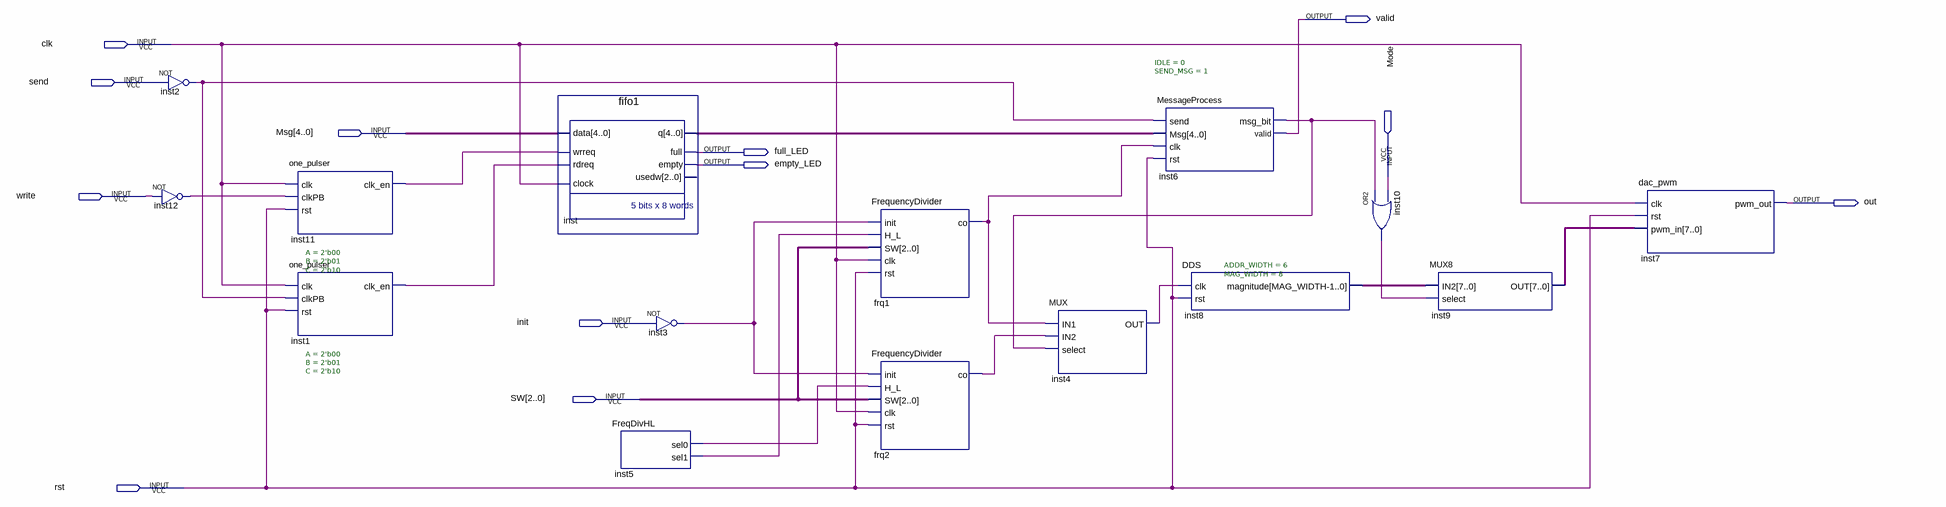
[diagram p0: schematic sheet]
// Quartus schematic DigitalModulation.bdf as structural Verilog: 15 symbols, 12 pins
module DigitalModulation (
  input  clk,
  input  send,
  input  [4:0] Msg,
  input  Mode,
  input  write,
  input  init,
  input  [2:0] SW,
  input  rst,
  output valid,
  output full_LED,
  output empty_LED,
  output out
);

  wire frq1_co, frq2_co, inst1_clk_en, inst2_out, inst3_out, inst4_out, inst5_sel0, inst5_sel1,
       inst6_msg_bit, inst10_out, inst11_clk_en, inst12_out;
  wire [4:0] inst_q;
  wire [7:0] inst8_magnitude, inst9_out;

  not inst2 (inst2_out, send);
  not inst12 (inst12_out, write);
  one_pulser #(.A(2'b00), .B(2'b01), .C(2'b10)) inst11 (
    .clk(clk), .clkPB(inst12_out), .rst(rst), .clk_en(inst11_clk_en));
  one_pulser #(.A(2'b00), .B(2'b01), .C(2'b10)) inst1 (.clk(clk), .clkPB(inst2_out), .rst(rst), .clk_en(inst1_clk_en));
  fifo1 inst (
    .data(Msg), .wrreq(inst11_clk_en), .rdreq(inst1_clk_en), .clock(clk), .q(inst_q), .full(full_LED),
    .empty(empty_LED));  // open: usedw
  FreqDivHL inst5 (.sel0(inst5_sel0), .sel1(inst5_sel1));
  not inst3 (inst3_out, init);
  FrequencyDivider frq1 (.init(inst3_out), .H_L(inst5_sel1), .SW(SW), .clk(clk), .rst(rst), .co(frq1_co));
  FrequencyDivider frq2 (.init(inst3_out), .H_L(inst5_sel0), .SW(SW), .clk(clk), .rst(rst), .co(frq2_co));
  MUX inst4 (.IN1(frq1_co), .IN2(frq2_co), .select(inst6_msg_bit), .OUT(inst4_out));
  MessageProcess #(.IDLE(0), .SEND_MSG(1)) inst6 (
    .send(inst2_out), .Msg(inst_q), .clk(frq1_co), .rst(rst), .msg_bit(inst6_msg_bit), .valid(valid));
  DDS #(.ADDR_WIDTH(6), .MAG_WIDTH(8)) inst8 (.clk(inst4_out), .rst(rst), .magnitude(inst8_magnitude));
  or inst10 (inst10_out, inst6_msg_bit, Mode);
  MUX8 inst9 (.IN2(inst8_magnitude), .select(inst10_out), .OUT(inst9_out));
  dac_pwm inst7 (.clk(clk), .rst(rst), .pwm_in(inst9_out), .pwm_out(out));
endmodule
